# EAGLE design ps (EAGLE 7.2.0)
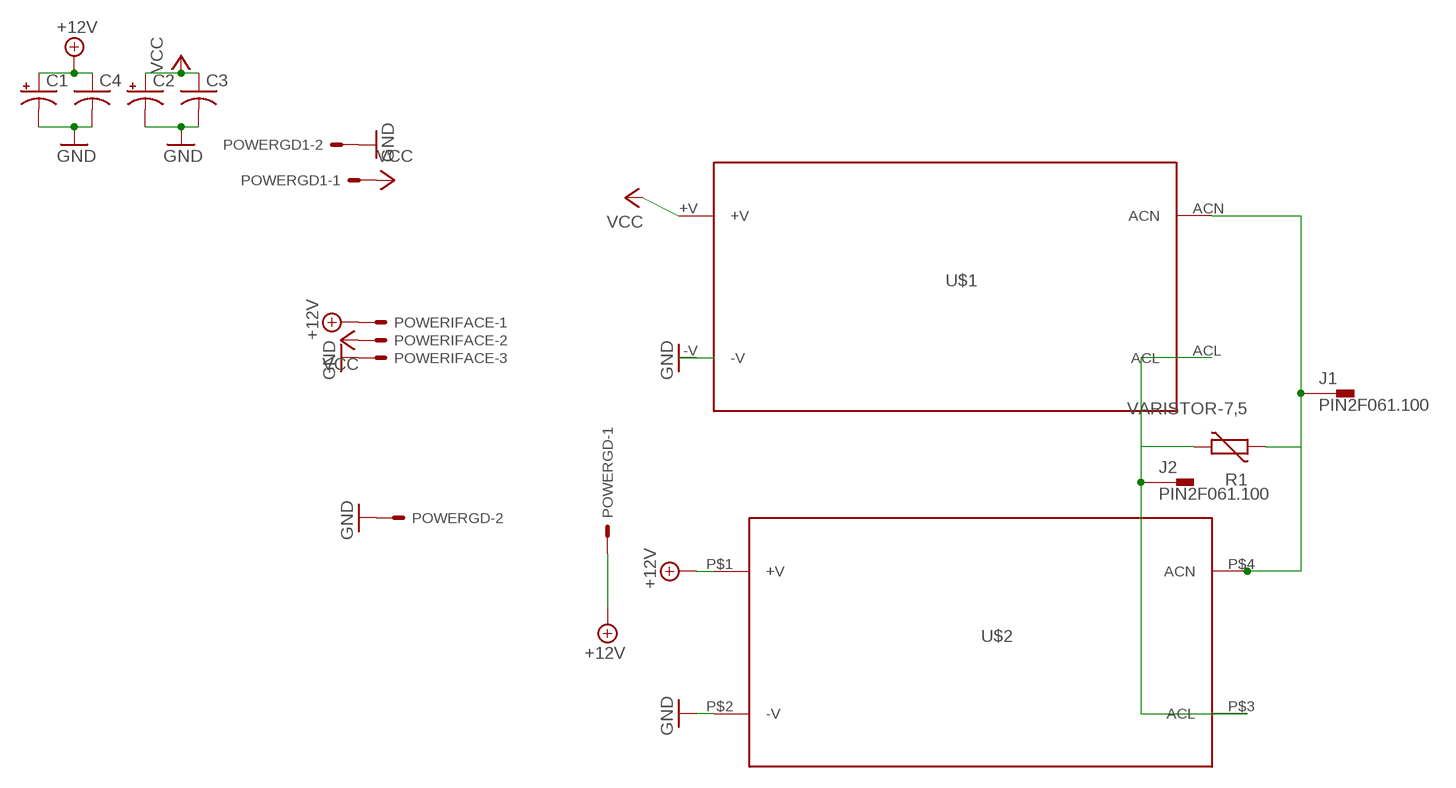
[diagram p0: schematic, sheet 1]

## Parts
C1  CPOL-USE5-13  [E5-13]
C2  CPOL-USE5-13  [E5-13]
C3  C-US050-050X075  [C050-050X075]
C4  C-US050-050X075  [C050-050X075]
J1  PIN2F061.100  [F061.100]
J2  PIN2F061.100  [F061.100]
POWERGD  KK-156-2  [KK-156-2]
POWERGD1  KK-156-2  [KK-156-2]
POWERIFACE  KK-156-3  [KK-156-3]
R1  VARISTOR-7,5  [R-7,5]
U$1  IRM-05-05  [IRM-05-05]
U$2  IRM-60-12  [IRM-60-12]

## Nets
+12V: C1.+ C4.1 POWERGD.1 POWERIFACE.1 U$2.P$1(+V)
GND: C1.- C2.- C3.2 C4.2 POWERGD1.2 POWERGD.2 POWERIFACE.3 U$1.-V U$2.P$2(-V)
N$1: J1.A1 J1.A2 R1.2 U$1.ACN U$2.P$4(ACN)
N$2: J2.A1 J2.A2 R1.1 U$1.ACL U$2.P$3(ACL)
VCC: C2.+ C3.1 POWERGD1.1 POWERIFACE.2 U$1.+V

## Library data of the parts
C1 C2 = rcl:CPOL-US: POLARIZED CAPACITOR, American symbol
C3 C4 = rcl:C-US: CAPACITOR, American symbol
J1 J2 = con-faston:PIN2: Flachstecker Typ Tyco/Electronics/AMP TAB, FASTON Printed Circuit Board Tabs Source: http://www.buerklin.com, http://catalog.tycoelectronics.com; OC_FARNELL: unknown; OC_NEWARK: unknown
POWERGD POWERGD1 = con-molex:KK-156-2: KK 156 HEADER Source: http://www.molex.com/pdm_docs/sd/026604100_sd.pdf; OC_FARNELL: unknown; OC_NEWARK: unknown
POWERIFACE = con-molex:KK-156-3: KK 156 HEADER Source: http://www.molex.com/pdm_docs/sd/026604100_sd.pdf; OC_FARNELL: unknown; OC_NEWARK: unknown
R1 = varistor:VARISTOR: VARISTOR
U$1 = meanwell:IRM-05-05
U$2 = meanwell:IRM-60-12

## Board
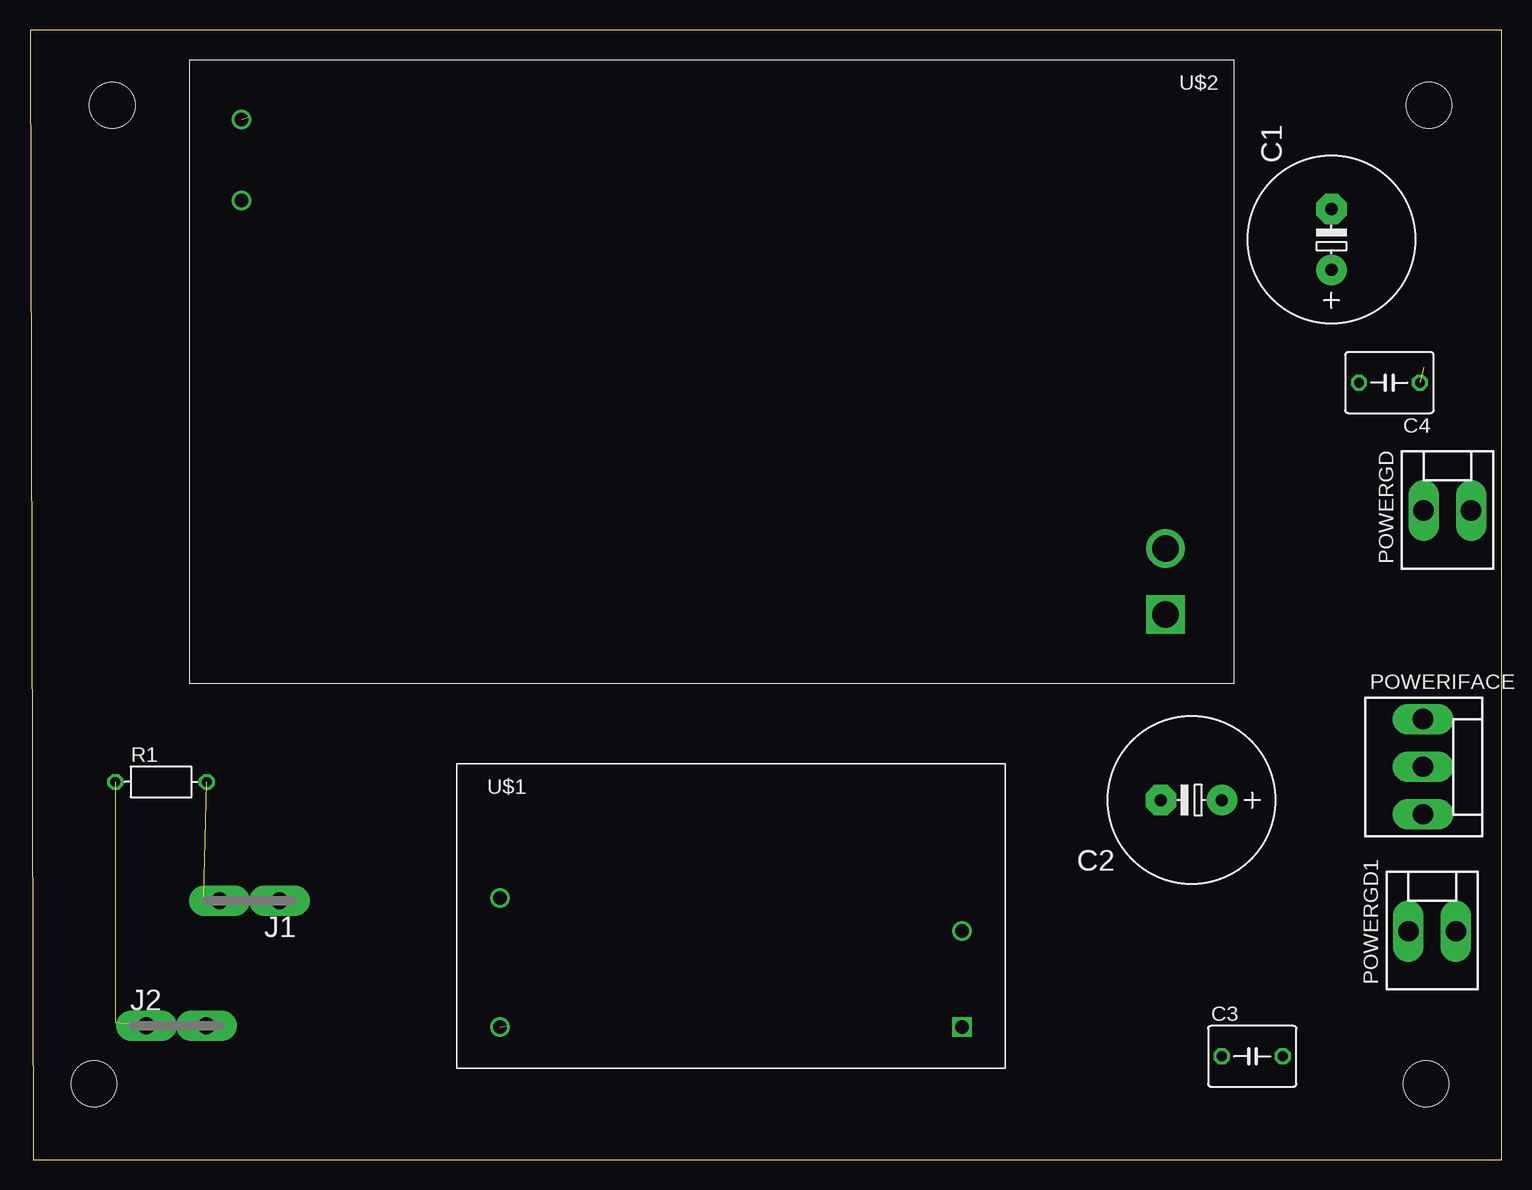
[diagram p1: board, top side]
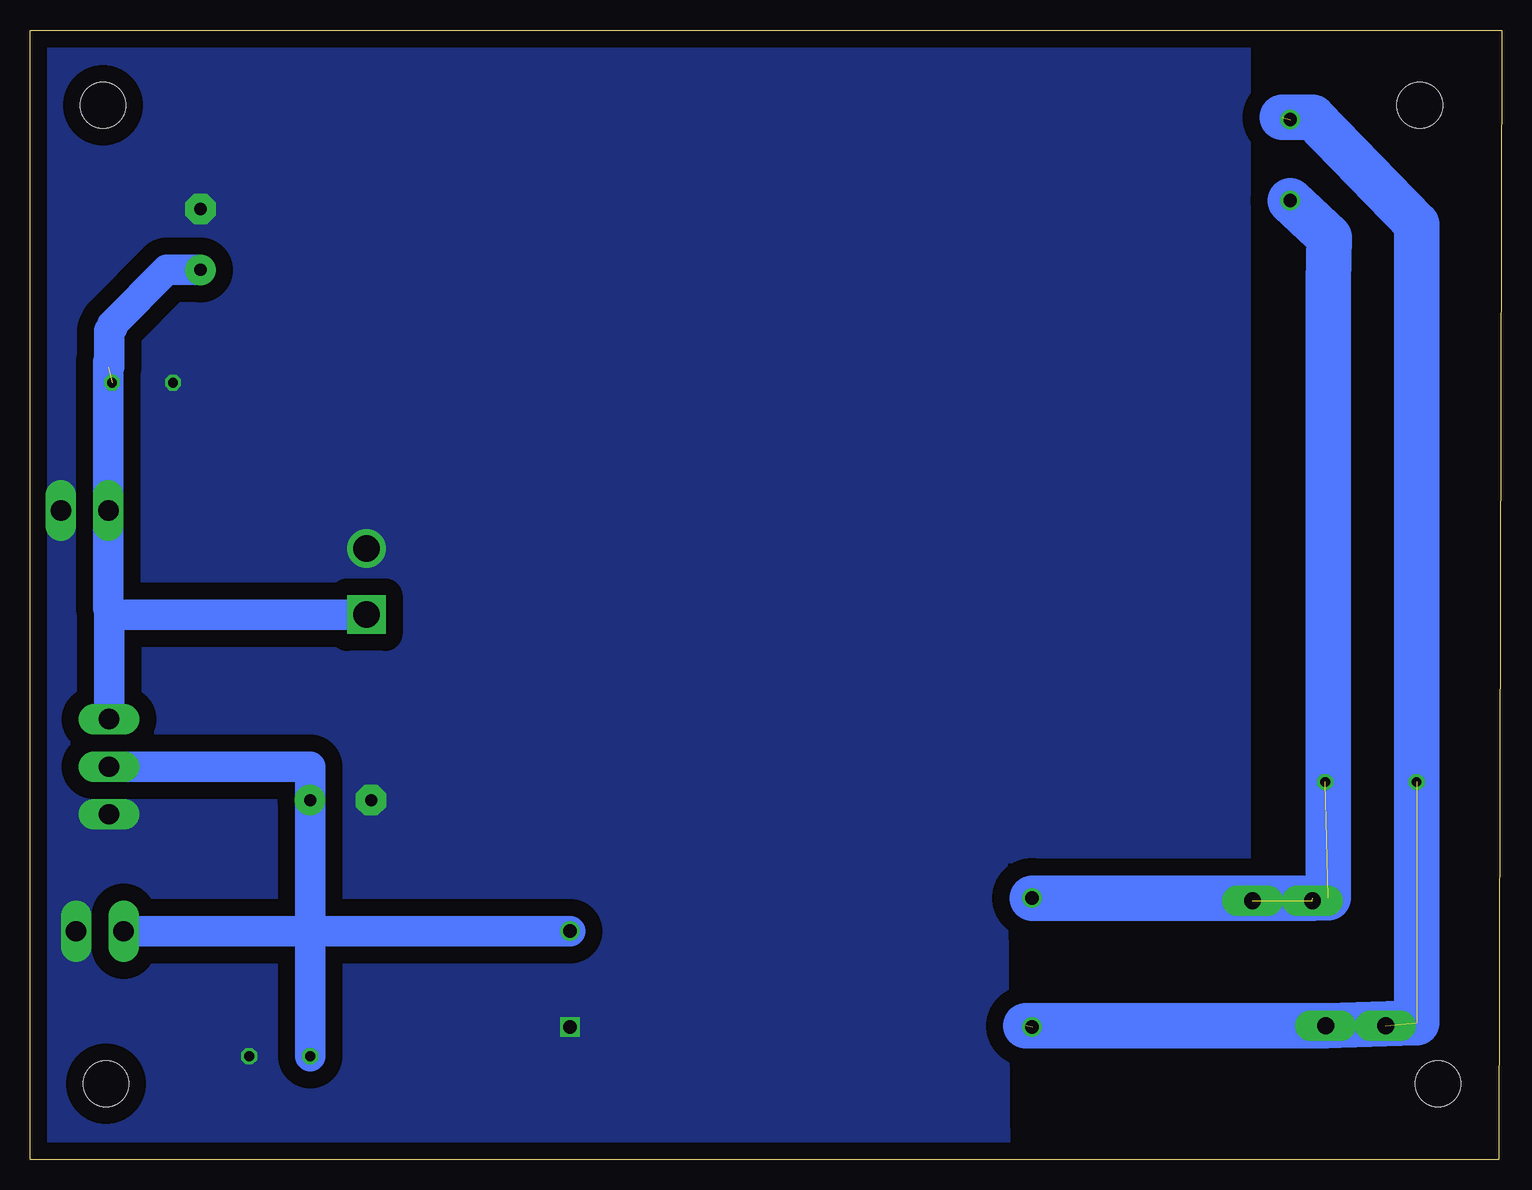
[diagram p2: board, bottom side, seen from below]

Size 122.66 x 94.16 mm. Coordinates in mm from the lower left corner, seen from the top.
Outline: 0.25,0 122.66,0 122.66,94.16 0,94.16 0.25,0
Copper layers (1*16): Top 0.035mm / dielectric 1.5mm / Bottom 0.035mm
Design rules "default": minimum track width 10mil, minimum drill 24mil, track to track 8mil, track to pad 8mil, pad to pad 8mil, via to via 8mil, smd to smd 8mil, copper to edge 40mil, drill to drill 8mil, minimum pad ring 10mil, minimum via ring 8mil, stop-mask expansion 4mil, vias tented up to drill 0mil, thermal gap 10mil
Holes 3.8 mm at 116.59,87.88 116.33,6.35 6.86,87.88 5.33,6.35

### Footprints (pad centres in the part's own frame; a part is rotated, then mirrored left to right if it is on the bottom)
E5-13 = drill 1.016 pad 2.54: + -2.54,0 | drill 1.016 pad 2.54 octagon: - 2.54,0
C050-050X075 = drill 0.813 octagon: 1 -2.54,0; 2 2.54,0
F061.100 = drill 1.4 pad 2.54 long: A1 -2.5,0; A2 2.5,0
KK-156-2 = drill 1.7 pad 2.184 long: 1 -1.98,0; 2 1.98,0
KK-156-3 = drill 1.7 pad 2.184 long: 1 -3.96,0; 2 0,0; 3 3.96,0
R-7,5 = drill 0.813 octagon: 1 -3.81,0; 2 3.81,0
IRM-05-05 = drill 1.1: +V 42.1,11.45; ACL 3.6,3.45; ACN 3.6,14.2 | drill 1.1 square: -V 42.1,3.45
IRM-60-12 = drill 2.2 square: P$1 5.7,46.25 | drill 2.2: P$2 5.7,40.75 | drill 1.1: P$3 82.7,5; P$4 82.7,11.75

### Placement (x,y rotation side)
C1  108.46,76.71 90 top
C2  96.77,29.97 180 top
C3  101.85,8.64 0 top
C4  113.28,64.77 180 top
J1  18.29,21.59 180 top
J2  12.19,11.18 0 top
POWERGD  118.11,54.1 0 top
POWERGD1  116.84,19.05 0 top
POWERIFACE  116.08,32.77 270 top
R1  10.92,31.5 0 top
U$1  35.56,7.62 0 top
U$2  100.33,91.69 180 top

### Tracks (layer width: path | path; a pad name or v marks a point on that pad's centre or on a via)
+12V  (1 unrouted)
  Bottom 2.54: 116.13,66.04 POWERGD.1 116.13,45.97 | 116.13,66.04 116.13,66.5 | C1.+ 111.25,74.17 115.82,69.6 115.82,69.34 116.08,69.09 116.08,66.09 116.13,66.04 | U$2.P$1 115.6,45.44 116.13,45.97 | 116.13,45.97 116.08,45.97 POWERIFACE.1
GND
  pour Bottom (isolate 1.422, no thermals): 41.91,94.23 122.68,93.98 122.68,0 41.15,0
N$1  (3 unrouted)
  Bottom 3.81: U$1.ACN 15.77,21.82 14.48,21.84 14.48,73.15 14.41,76.9 U$2.P$4
N$2  (4 unrouted)
  Bottom 3.81: 39.67,11.18 J2.A2 7.11,11.43 7.11,77.98 15.75,86.87 18.29,86.87
N$3
  pour Bottom (isolate 1.422, no thermals): 21.08,93.73 42.93,93.73 43.18,24.89 21.08,25.15
VCC
  Bottom 2.54: U$1.+V 92.46,19.07 92.2,19.05 99.31,19.05 | 99.31,19.05 C2.+ 99.31,32.77 POWERIFACE.2 | 99.31,19.05 C3.1 | POWERGD1.1 99.31,19.05